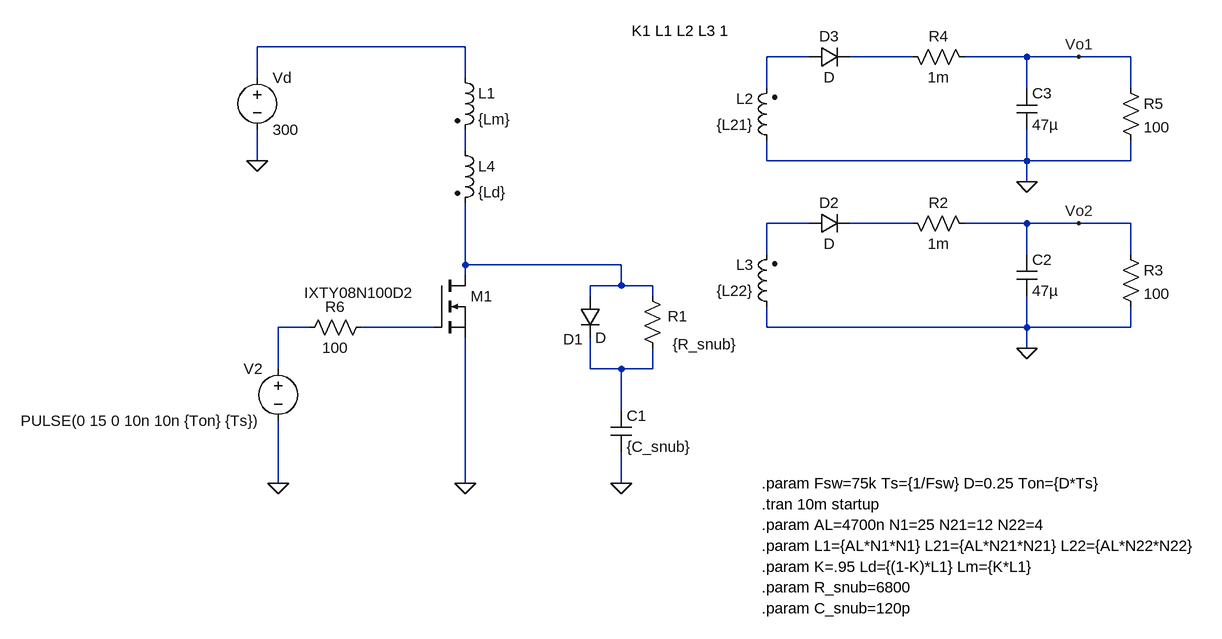
[diagram p0: schematic sch.asc]
sch.asc, the LTspice schematic file:
Version 4
SHEET 1 1032 856
WIRE -400 -352 -720 -352
WIRE 128 -336 64 -336
WIRE 288 -336 192 -336
WIRE 464 -336 368 -336
WIRE 544 -336 464 -336
WIRE 624 -336 544 -336
WIRE -720 -304 -720 -352
WIRE -400 -304 -400 -352
WIRE 64 -288 64 -336
WIRE 464 -288 464 -336
WIRE 624 -288 624 -336
WIRE -400 -192 -400 -224
WIRE -720 -176 -720 -224
WIRE 64 -176 64 -208
WIRE 464 -176 464 -224
WIRE 464 -176 64 -176
WIRE 624 -176 624 -208
WIRE 624 -176 464 -176
WIRE 464 -144 464 -176
WIRE 128 -80 64 -80
WIRE 288 -80 192 -80
WIRE 464 -80 368 -80
WIRE 544 -80 464 -80
WIRE 624 -80 544 -80
WIRE 64 -32 64 -80
WIRE 464 -32 464 -80
WIRE 624 -32 624 -80
WIRE -400 -16 -400 -112
WIRE -160 -16 -400 -16
WIRE -400 0 -400 -16
WIRE -160 16 -160 -16
WIRE -160 16 -208 16
WIRE -112 16 -160 16
WIRE -208 32 -208 16
WIRE -112 32 -112 16
WIRE -640 80 -688 80
WIRE -448 80 -560 80
WIRE 64 80 64 48
WIRE 464 80 464 32
WIRE 464 80 64 80
WIRE 624 80 624 48
WIRE 624 80 464 80
WIRE 464 112 464 80
WIRE -688 144 -688 80
WIRE -208 144 -208 96
WIRE -160 144 -208 144
WIRE -112 144 -112 112
WIRE -112 144 -160 144
WIRE -160 208 -160 144
WIRE -688 320 -688 224
WIRE -400 320 -400 96
WIRE -160 320 -160 272
FLAG -400 320 0
FLAG -688 320 0
FLAG -720 -176 0
FLAG 544 -336 Vo1
FLAG 544 -80 Vo2
FLAG 464 -144 0
FLAG 464 112 0
FLAG -160 320 0
SYMBOL voltage -720 -320 R0
WINDOW 123 0 0 Left 0
WINDOW 39 0 0 Left 0
SYMATTR InstName Vd
SYMATTR Value 300
SYMBOL voltage -688 128 M0
WINDOW 123 0 0 Left 0
WINDOW 39 0 0 Left 0
SYMATTR InstName V2
SYMATTR Value PULSE(0 15 0 10n 10n {Ton} {Ts})
SYMBOL ind2 -416 -320 R0
SYMATTR InstName L1
SYMATTR Value {Lm}
SYMATTR Type ind
SYMBOL ind2 80 64 R180
WINDOW 0 36 80 Left 2
WINDOW 3 36 40 Left 2
SYMATTR InstName L3
SYMATTR Value {L22}
SYMATTR Type ind
SYMBOL diode 128 -64 R270
WINDOW 0 32 32 VTop 2
WINDOW 3 0 32 VBottom 2
SYMATTR InstName D2
SYMBOL res 272 -96 M90
WINDOW 0 0 56 VBottom 2
WINDOW 3 32 56 VTop 2
SYMATTR InstName R2
SYMATTR Value 1m
SYMBOL cap 448 -32 R0
SYMATTR InstName C2
SYMATTR Value 47µ
SYMBOL res 608 -48 R0
SYMATTR InstName R3
SYMATTR Value 100
SYMBOL ind2 80 -192 R180
WINDOW 0 36 80 Left 2
WINDOW 3 36 40 Left 2
SYMATTR InstName L2
SYMATTR Value {L21}
SYMATTR Type ind
SYMBOL diode 128 -320 R270
WINDOW 0 32 32 VTop 2
WINDOW 3 0 32 VBottom 2
SYMATTR InstName D3
SYMBOL res 272 -352 M90
WINDOW 0 0 56 VBottom 2
WINDOW 3 32 56 VTop 2
SYMATTR InstName R4
SYMATTR Value 1m
SYMBOL cap 448 -288 R0
SYMATTR InstName C3
SYMATTR Value 47µ
SYMBOL res 608 -304 R0
SYMATTR InstName R5
SYMATTR Value 100
SYMBOL nmos -448 0 R0
WINDOW 3 -200 27 Left 2
SYMATTR InstName M1
SYMATTR Value IXTY08N100D2
SYMBOL ind2 -416 -208 R0
SYMATTR InstName L4
SYMATTR Value {Ld}
SYMATTR Type ind
SYMBOL res -96 128 R180
WINDOW 0 -38 65 Left 2
WINDOW 3 -115 22 Left 2
SYMATTR InstName R1
SYMATTR Value {R_snub}
SYMBOL cap -176 208 R0
SYMATTR InstName C1
SYMATTR Value {C_snub}
SYMBOL diode -224 32 R0
WINDOW 0 -25 66 Left 2
SYMATTR InstName D1
SYMBOL res -544 64 R90
WINDOW 0 0 56 VBottom 2
WINDOW 3 32 56 VTop 2
SYMATTR InstName R6
SYMATTR Value 100
TEXT -144 -376 Left 2 !K1 L1 L2 L3 1
TEXT 56 352 Left 2 !.tran 10m startup
TEXT 56 320 Left 2 !.param Fsw=75k Ts={1/Fsw} D=0.25 Ton={D*Ts}
TEXT 56 384 Left 2 !.param AL=4700n N1=25 N21=12 N22=4
TEXT 56 416 Left 2 !.param L1={AL*N1*N1} L21={AL*N21*N21} L22={AL*N22*N22}
TEXT 56 448 Left 2 !.param K=.95 Ld={(1-K)*L1} Lm={K*L1}
TEXT 56 480 Left 2 !.param R_snub=6800
TEXT 56 512 Left 2 !.param C_snub=120p

The netlist it stands for:
* sch.asc
Vd N001 0 300
V2 N008 0 PULSE(0 15 0 10n 10n {Ton} {Ts})
L1 N001 N004 {Lm}
L3 0 N005 {L22}
D2 N005 N006 D
R2 N006 Vo2 1m
C2 Vo2 0 47µ
R3 Vo2 0 100
L2 0 N002 {L21}
D3 N002 N003 D
R4 N003 Vo1 1m
C3 Vo1 0 47µ
R5 Vo1 0 100
M1 N007 N009 0 0 IXTY08N100D2
L4 N004 N007 {Ld}
R1 N010 N007 {R_snub}
C1 N010 0 {C_snub}
D1 N007 N010 D
R6 N009 N008 100
.model D D
.lib standard.dio
.model NMOS NMOS
.model PMOS PMOS
.lib standard.mos
K1 L1 L2 L3 1
.tran 10m startup
.param Fsw=75k Ts={1/Fsw} D=0.25 Ton={D*Ts}
.param AL=4700n N1=25 N21=12 N22=4
.param L1={AL*N1*N1} L21={AL*N21*N21} L22={AL*N22*N22}
.param K=.95 Ld={(1-K)*L1} Lm={K*L1}
.param R_snub=6800
.param C_snub=120p
.backanno
.end